# EAGLE design incubator (EAGLE 9.2.2)
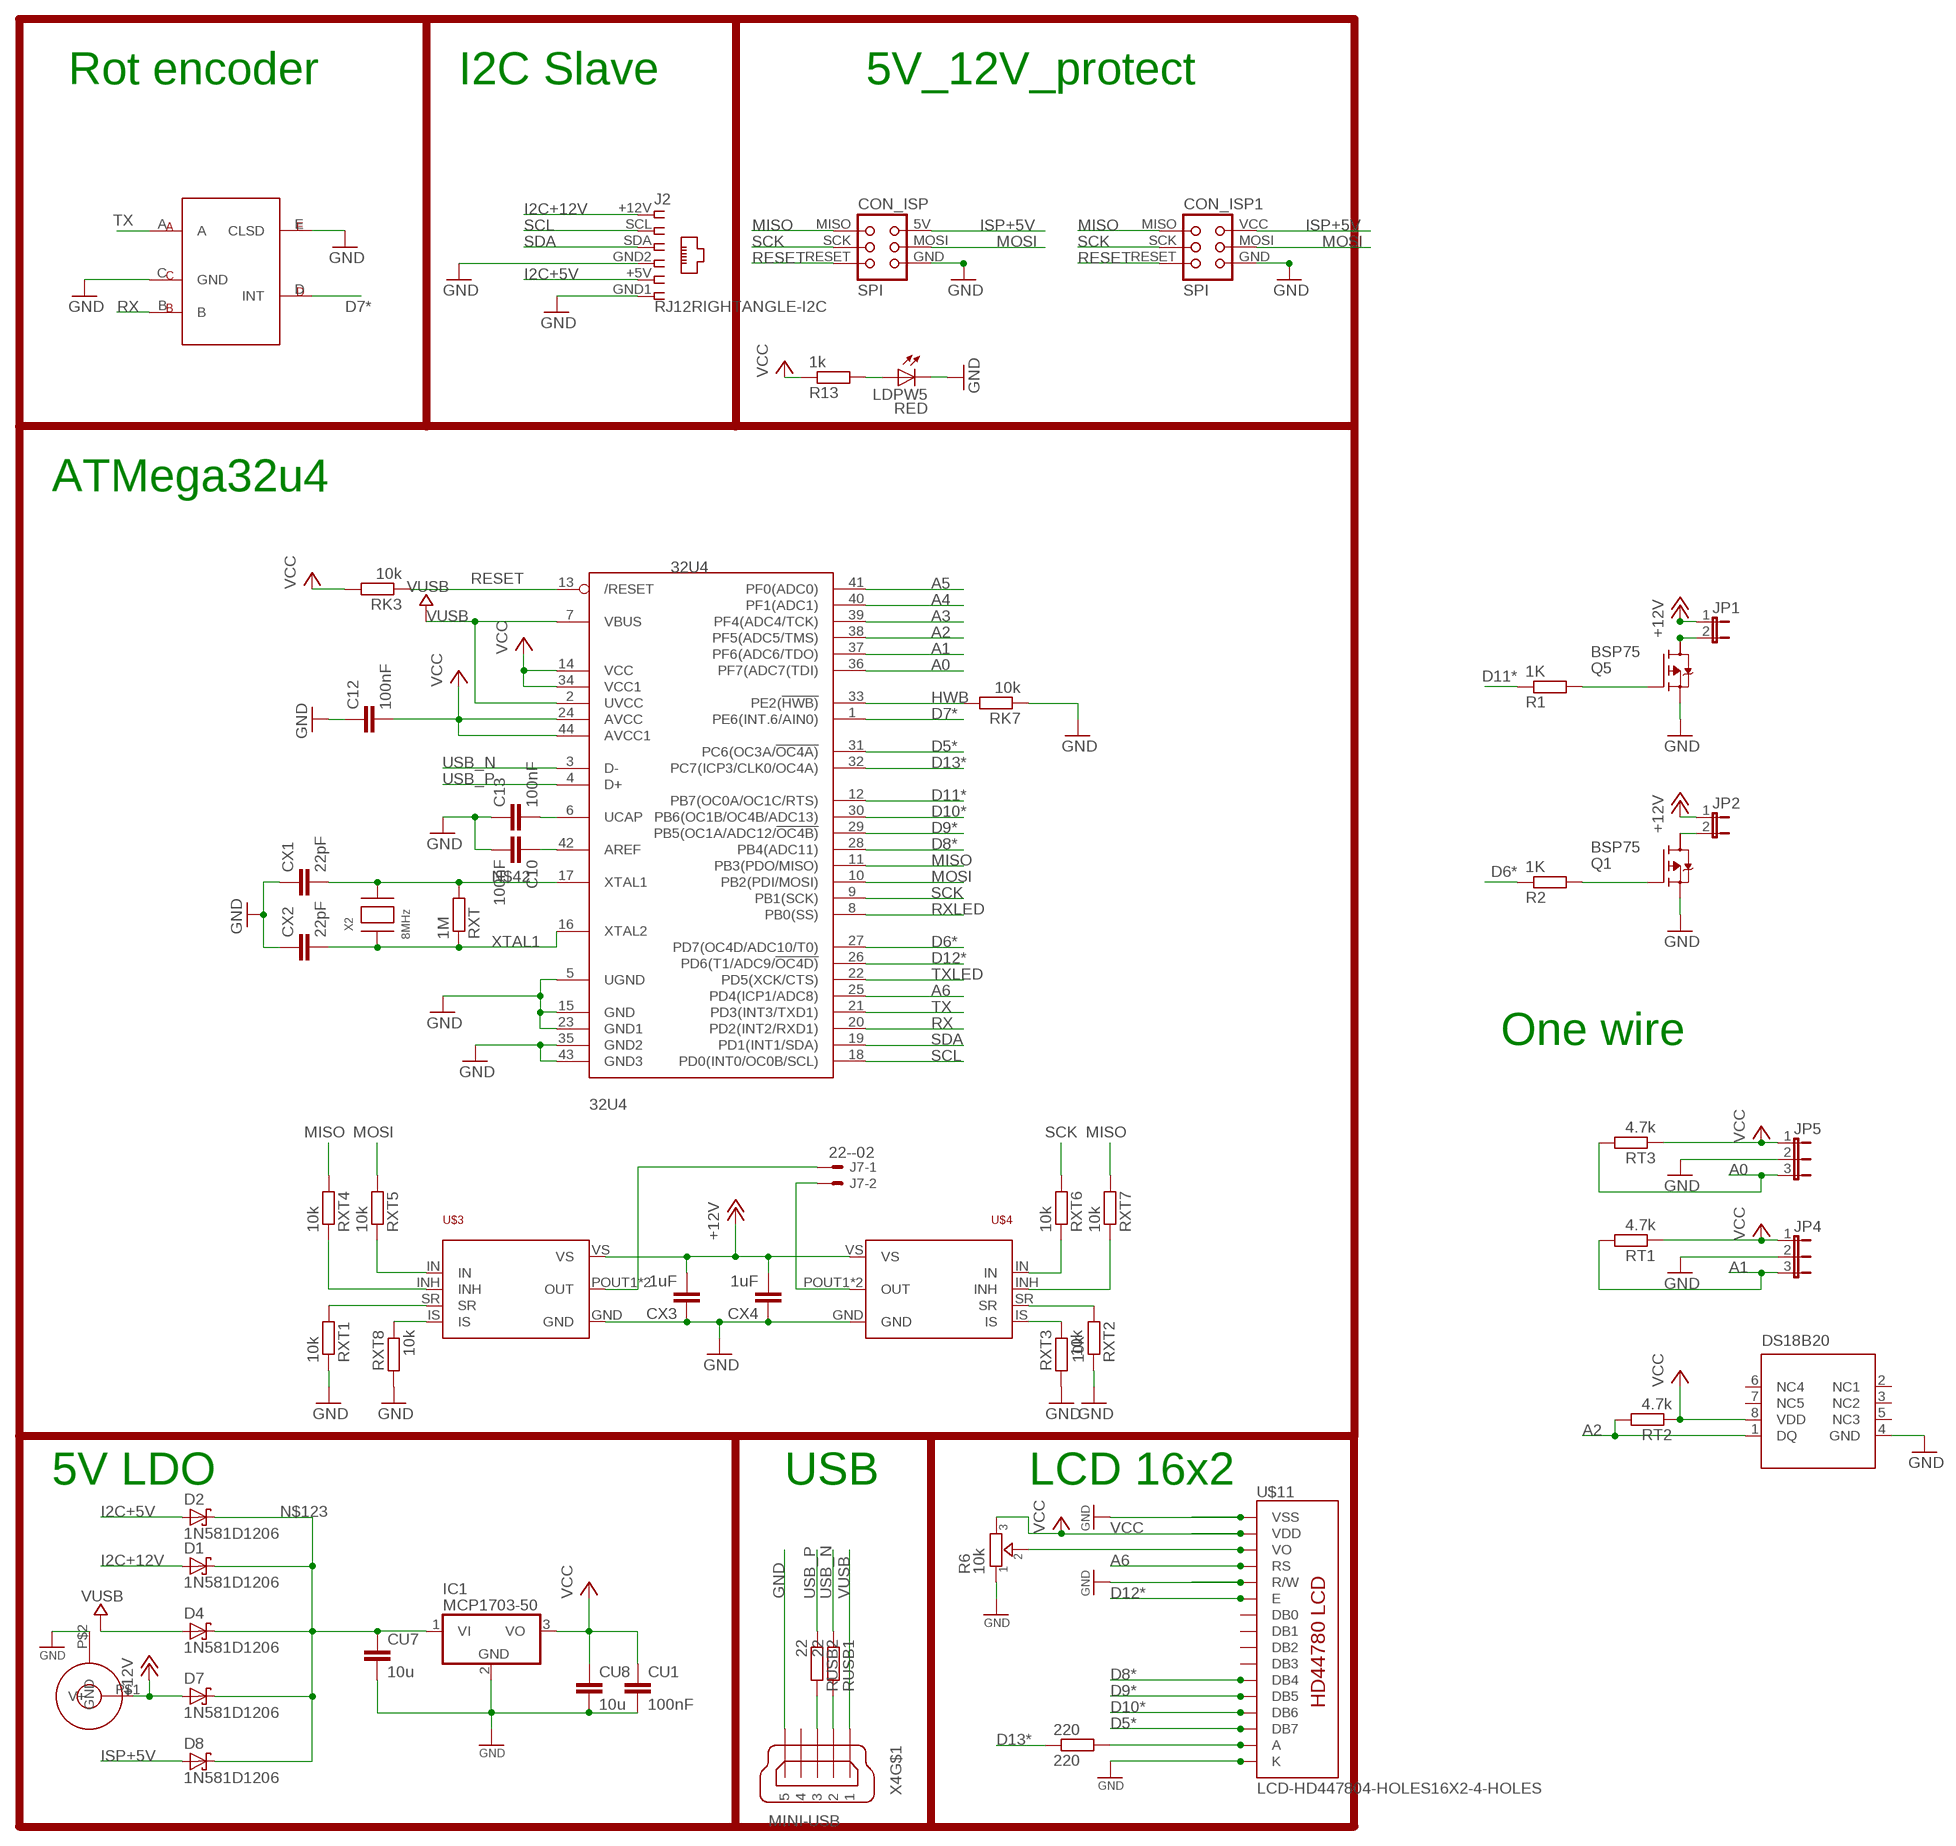
[diagram p0: schematic, sheet 1]

## Parts
32U4  32U4  ATMEGA32U4-AU  [TQFP44]
220  220  R-EU_R0805  [R0805]
C10  100nF  C-EUC0805  [C0805]
C12  100nF  C-EUC0805  [C0805]
C13  100nF  C-EUC0805  [C0805]
CON_ISP  SPI  TINYISPT  [TC2030-MCP-NL]
CON_ISP1  SPI  TINYISP  [TINYISP]
CU1  100nF  C-EUC0805  [C0805]
CU7  10u  C-EUC0805  [C0805]
CU8  10u  C-EUC0805  [C0805]
CX1  22pF  C-EUC0805  [C0805]
CX2  22pF  C-EUC0805  [C0805]
CX3  1uF  C-EUC0805  [C0805]
CX4  1uF  C-EUC0805  [C0805]
D1  1N581D1206  [LED-1206]
D2  1N581D1206  [LED-1206]
D4  1N581D1206  [LED-1206]
D7  1N581D1206  [LED-1206]
D8  1N581D1206  [LED-1206]
IC1  MCP1703-50  MCP1703DB  [SOT223]
J2  RJ12RIGHTANGLE-I2C  [RJ12-RIGHTANGLE-I2C]
J7  22--02  [2-PIN-5.08S]
JP1  JUMPER-2PTH  [1X02]
JP2  JUMPER-2PTH  [1X02]
JP4  JP2E  [JP2]
JP5  JP2E  [JP2]
LDPW5  RED  LEDCHIP-LED0805  [CHIP-LED0805]
POWER  JACK_DC_BARREL  [DC_BARREL]
Q1  BSP75  BSP613P  [PG-SOT-223]
Q5  BSP75  BSP613P  [PG-SOT-223]
R1  1K  R-EU_R0805  [R0805]
R2  1K  R-EU_R0805  [R0805]
R6  10k  TRIMMER-3362P  [TRIMMER_3362P]
R13  1k  R-EU_R0805  [R0805]
RK3  10k  R-EU_M0805  [M0805]
RK7  10k  R-EU_M0805  [M0805]
RT1  4.7k  R-EU_R0805  [R0805]
RT2  4.7k  R-EU_R0805  [R0805]
RT3  4.7k  R-EU_R0805  [R0805]
RUSB1  22  R-EU_M0805  [M0805]
RUSB2  22  R-EU_M0805  [M0805]
RXT  1M  R-EU_R0805  [R0805]
RXT1  10k  R-EU_R0805  [R0805]
RXT2  10k  R-EU_R0805  [R0805]
RXT3  10k  R-EU_R0805  [R0805]
RXT4  10k  R-EU_R0805  [R0805]
RXT5  10k  R-EU_R0805  [R0805]
RXT6  10k  R-EU_R0805  [R0805]
RXT7  10k  R-EU_R0805  [R0805]
RXT8  10k  R-EU_R0805  [R0805]
U$1  ROTARYENCODER  [ROTARYENCODER]
U$3  BTS7960  [P-TO-263-7]
U$4  BTS7960  [P-TO-263-7]
U$5  DS18B20  DS18B20SMALL  [MSOP8]
U$11  LCD-HD447804-HOLES16X2-4-HOLES  [LCD-16X2-4HOLES]
X2  8MHz  XTALNX6035  [NX6035]
X4  MINI-USB  MINI-USB-SCHIELD-32005-201  [32005-201]

## Nets
+12V [power]: CX3.2 CX4.2 D7.A JP1.1 JP2.1 POWER.P$1(V+) U$3.VS U$4.VS
A0: 32U4.36(PF7(ADC7(TDI)) JP5.3 RT3.2
A1: 32U4.37(PF6(ADC6/TDO)) JP4.3 RT1.2
A2: 32U4.38(PF5(ADC5/TMS)) RT2.2 U$5.1(DQ)
A3: 32U4.39(PF4(ADC4/TCK))
A4: 32U4.40(PF1(ADC1))
A5: 32U4.41(PF0(ADC0))
A6: 32U4.25(PD4(ICP1/ADC8)) U$11.4(RS)
AREF: 32U4.42(AREF) C10.1
D5*: 32U4.31(PC6(OC3A/!OC4A)) U$11.14(DB7)
D6*: 32U4.27(PD7(OC4D/ADC10/T0)) R2.1
D7*: 32U4.1(PE6(INT.6/AIN0)) U$1.D(INT)
D8*: 32U4.28(PB4(ADC11)) U$11.11(DB4)
D9*: 32U4.29(PB5(OC1A/ADC12/!OC4B)) U$11.12(DB5)
D10*: 32U4.30(PB6(OC1B/OC4B/ADC13)) U$11.13(DB6)
D11*: 32U4.12(PB7(OC0A/OC1C/RTS)) R1.1
D12*: 32U4.26(PD6(T1/ADC9/!OC4D)) U$11.6(E)
D13*: 32U4.32(PC7(ICP3/CLK0/OC4A)) 220.1
GND [power]: 32U4.5(UGND) 32U4.15(GND) 32U4.23(GND1) 32U4.35(GND2) 32U4.43(GND3) C10.2 C12.1 C13.1 CON_ISP1.GND CON_ISP.GND CU1.2 CU7.2 CU8.2 CX1.1 CX2.1 CX3.1 CX4.1 IC1.2(GND) J2.GND1 J2.GND2 JP4.2 JP5.2 LDPW5.C POWER.P$2(GND) Q1.3(S) Q5.3(S) R6.1 RK7.1 RXT1.1 RXT2.1 RXT3.2 RXT8.2 U$1.C(GND) U$1.E(CLSD) U$3.GND U$4.GND U$5.4(GND) U$11.1(VSS) U$11.5(R/W) U$11.16(K) X4.5
HWB: 32U4.33(PE2(!HWB)) RK7.2
I2C+5V: D2.A J2.+5V
I2C+12V [power]: D1.A J2.+12V
ISP+5V: CON_ISP1.VCC CON_ISP.5V(VCC) D8.A
MISO: 32U4.11(PB3(PDO/MISO)) CON_ISP1.MISO CON_ISP.MISO RXT4.2 RXT7.2
MOSI: 32U4.10(PB2(PDI/MOSI)) CON_ISP1.MOSI CON_ISP.MOSI RXT5.2
N$1: 32U4.6(UCAP) C13.2
N$2: R6.2 U$11.3(VO)
N$4: RXT5.1 U$3.IN
N$5: RXT6.1 U$4.IN
N$6: RXT4.1 U$3.INH
N$7: RXT7.1 U$4.INH
N$8: RXT3.1 U$4.IS
N$9: Q5.1(G) R1.2
N$10: RXT2.2 U$4.SR
N$11: 220.2 U$11.15(A)
N$12: LDPW5.A R13.2
N$13: RXT1.2 U$3.SR
N$14: RXT8.1 U$3.IS
N$19: J7.1 U$3.POUT1(OUT) U$3.POUT2(OUT)
N$20: Q1.1(G) R2.2
N$21: JP1.2 Q5.2(D)
N$22: J7.2 U$4.POUT1(OUT) U$4.POUT2(OUT)
N$23: JP2.2 Q1.2(D)
N$42: 32U4.17(XTAL1) CX1.2 RXT.2 X2.P$2
N$123: CU7.1 D1.C D2.C D4.C D7.C D8.C IC1.1(VI)
RESET: 32U4.13(/RESET) CON_ISP1.RESET CON_ISP.RESET RK3.1
RX: 32U4.20(PD2(INT2/RXD1)) U$1.B
RXLED: 32U4.8(PB0(SS))
SCK: 32U4.9(PB1(SCK)) CON_ISP1.SCK CON_ISP.SCK RXT6.2
SCL: 32U4.18(PD0(INT0/OC0B/SCL)) J2.SCL
SDA: 32U4.19(PD1(INT1/SDA)) J2.SDA
TX: 32U4.21(PD3(INT3/TXD1)) U$1.A
TXLED: 32U4.22(PD5(XCK/CTS))
USB_N: 32U4.3(D-) RUSB1.1
USB_P: 32U4.4(D+) RUSB2.1
USBC_N: RUSB1.2 X4.2
USBC_P: RUSB2.2 X4.3
VCC: 32U4.14(VCC) 32U4.24(AVCC) 32U4.34(VCC1) 32U4.44(AVCC1) C12.2 CU1.1 CU8.1 IC1.3(VO) JP4.1 JP5.1 R6.3 R13.1 RK3.2 RT1.1 RT2.1 RT3.1 U$5.8(VDD) U$11.2(VDD)
VUSB: 32U4.2(UVCC) 32U4.7(VBUS) D4.A X4.1
XTAL1: 32U4.16(XTAL2) CX2.2 RXT.1 X2.P$1
Unconnected: Q1.4(D) Q5.4(D) U$5.2(NC1) U$5.3(NC2) U$5.5(NC3) U$5.6(NC4) U$5.7(NC5) U$11.7(DB0) U$11.8(DB1) U$11.9(DB2) U$11.10(DB3) X4.4 X4.M1(S:S1) X4.M2(S:S2) X4.M3(S:S3) X4.M4(S:S4)

## Notes on the sheet
- Rot encoder | I2C Slave | 5V_12V_protect
- ATMega32u4
- One wire
- 5V LDO | USB | LCD 16x2

## Library data of the parts
32U4 = adafruit:ATMEGA32U4: http://www.ladyada.net/library/eagle
220 R1 R2 RXT RXT1-RXT8 = rcl:R-EU_: RESISTOR, European symbol; SPICEPREFIX: R
C10 C12 C13 CU1 CU7 CU8 CX1-CX4 = rcl:C-EU: CAPACITOR, European symbol; SPICEPREFIX: C
CON_ISP = lpatiny:TINYISP: CONNECTOR
CON_ISP1 = lpatiny:TINYISP: CONNECTOR; OC_FARNELL: unknown; OC_NEWARK: unknown
D1 D2 D4 D7 D8 = lpatiny:1N581*: 1.0A SCHOTTKY BARRIER RECTIFIER Source: http://www.diodes.com/datasheets/ds23001.pdf
IC1 = linear:MCP1703: 250 mA, 16V, Low Quiescent Current LDO Regulator Source: http://ww1.microchip.com/downloads/en/DeviceDoc/22049b.pdf
J2 = lpatiny:RJ12: CORCOM Modular RJ Jacks No Shield Source: www.tycoelectronics.com .. ENG_DS_1654001_1099_RJ_L_0507.pdf
J7 = lpatiny:22-?-02: CONNECTOR wire to board 2.54 mm (.1 inch) pitch header
JP1 JP2 = SparkFun:JUMPER-2: Jumper Basic 0.1" spaced jumper. Use with breakaway headers.
JP4 JP5 = jumper:JP2E: JUMPER
LDPW5 = adafruit:LED: LED OSRAM: - CHIPLED LG R971, LG N971, LY N971, LG Q971, LY Q971, LO R971, LY R971 LH N974, LH R974 LS Q976, LO Q976, LY Q976 LO Q996 - Hyper CHIPLED LW Q18S LB Q993, LB Q99A, LB R99A - SideLED LS A670, LO A670, LY A670, LG A670, LP A670 LB A673, LV A673, LT A673, LW A673 LH A674 LY A675 LS A676, LA A676, LO A676, LY A676, LW A676 LS A679, LY A679, LG A679 - Hyper Micro SIDELED® LS Y876, LA Y876, LO Y876, LY Y876 LT Y87S - SmartLED LW L88C, LW L88S LB L89C, LB L89S, LG L890 LS L89K, LO L89K, LY L89K LS L896, LA L896, LO L896, LY L896 - TOPLED LS T670, LO T670, LY T670, LG T670, LP T670 LSG T670, LSP T670, LSY T670, LOP T670, LYG T670 LG T671, LOG T671, LSG T671 LB T673, LV T673, LT T673, LW T673 LH T674 LS T676, LA T676, LO T676, LY T676, LB T676, LH T676, LSB T676, LW T676 LB T67C, LV T67C, LT T67C, LS T67K, LO T67K, LY T67K, LW E67C LS E67B, LA E67B, LO E67B, LY E67B, LB E67C, LV E67C, LT E67C LW T67C LS T679, LY T679, LG T679 LS T770, LO T770, LY T770, LG T770, LP T770 LB T773, LV T773, LT T773, LW T773 LH T774 LS E675, LA E675, LY E675, LS T675 LS T776, LA T776, LO T776, LY T776, LB T776 LHGB T686 LT T68C, LB T68C - Hyper Mini TOPLED® LB M676 - Mini TOPLED Santana® LG M470 LS M47K, LO M47K, LY M47K Source: http://www.osram.convergy.de/
POWER = lpatiny:JACK_DC_BARREL
Q1 Q5 = infineon:BSP613P: SIPMOS (R) Small-Signal-Transistor P-Channel (2 Drain) Source: http://www.infineon.com/dgdl/BSP613P_Rev2.4.pdf; OC_FARNELL: unknown; OC_NEWARK: unknown
R6 = dp_devices:TRIMMER: Trimmer resistor
R13 RK3 RK7 RT1-RT3 RUSB1 RUSB2 = resistor:R-EU_: RESISTOR, European symbol
U$1 = RotaryEncoder:ROTARYENCODER
U$3 U$4 = BTS7960:BTS7960; AVAILABILITY: Warning; DESCRIPTION: Half Bridge Motor Driver 7-Pin%286%2BTab%29 TO-263; MF: Infineon; MP: BTS7960B; PACKAGE: TO-263 Infineon; PRICE: 4.95 USD
U$5 = lpatiny:DS18B20
U$11 = HD44780LCD:LCD-HD44780
X2 = lpatiny:XTAL: Low cost SMT crystals, no capacitors included http://www.ladyada.net/library/eagle
X4 = con-cypressindustries:MINI-USB-SCHIELD-: MINI USB-B Conector Source: www.cypressindustries.com; OC_FARNELL: unknown; OC_NEWARK: unknown

## Net classes
0 default: width 0.203 mm, clearance 0.25 mm
1 power: width 0.203 mm, drill 0.305 mm, clearance 0.25 mm
2 VIN: width 0.406 mm, clearance 0.25 mm
3 fine: width 0.406 mm, clearance 0.25 mm
4 aref: width 0.406 mm, clearance 0.25 mm

## Board
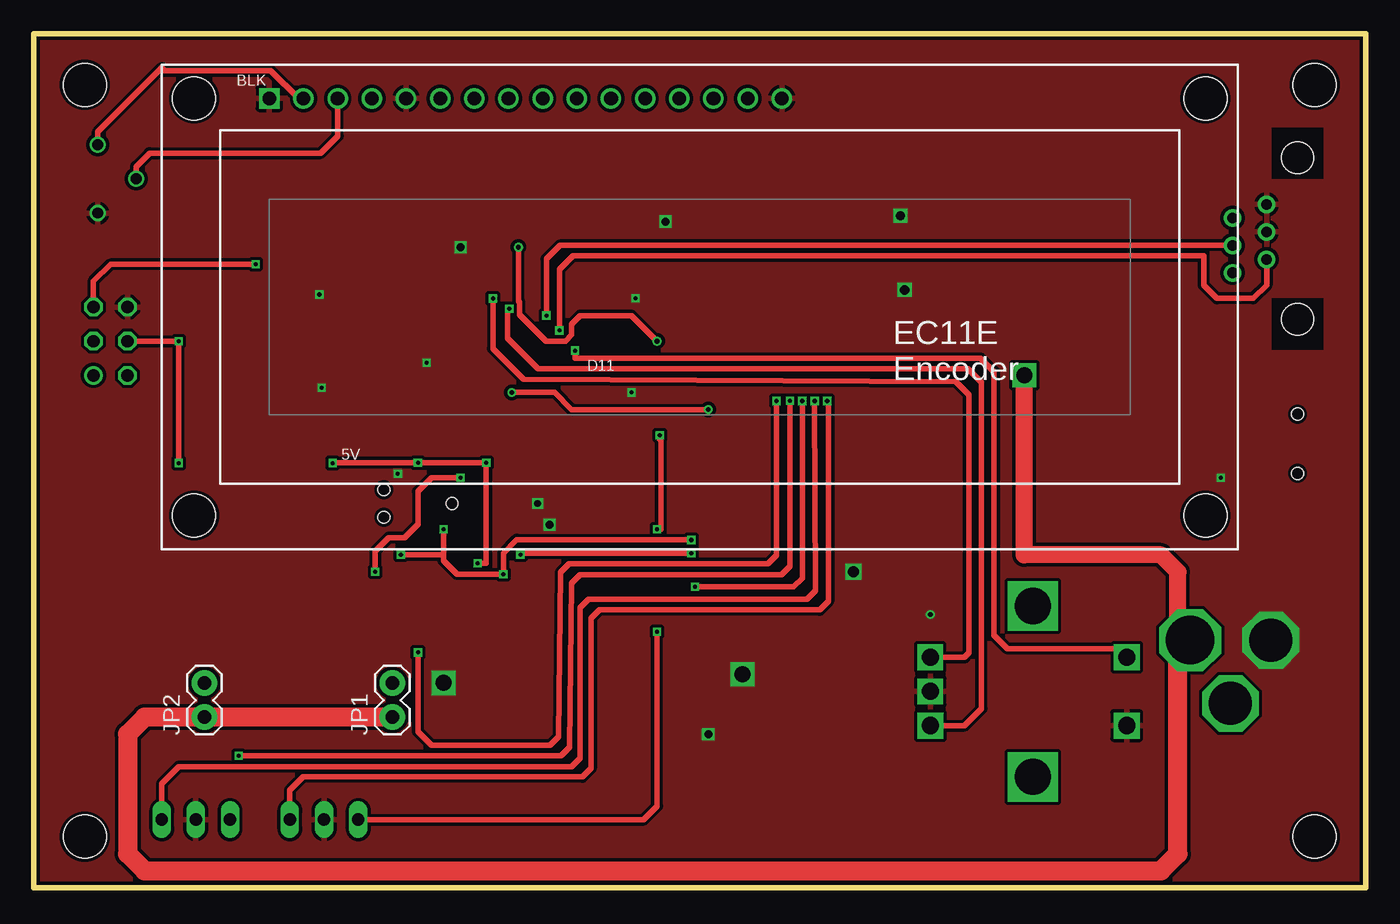
[diagram p1: board, top side]
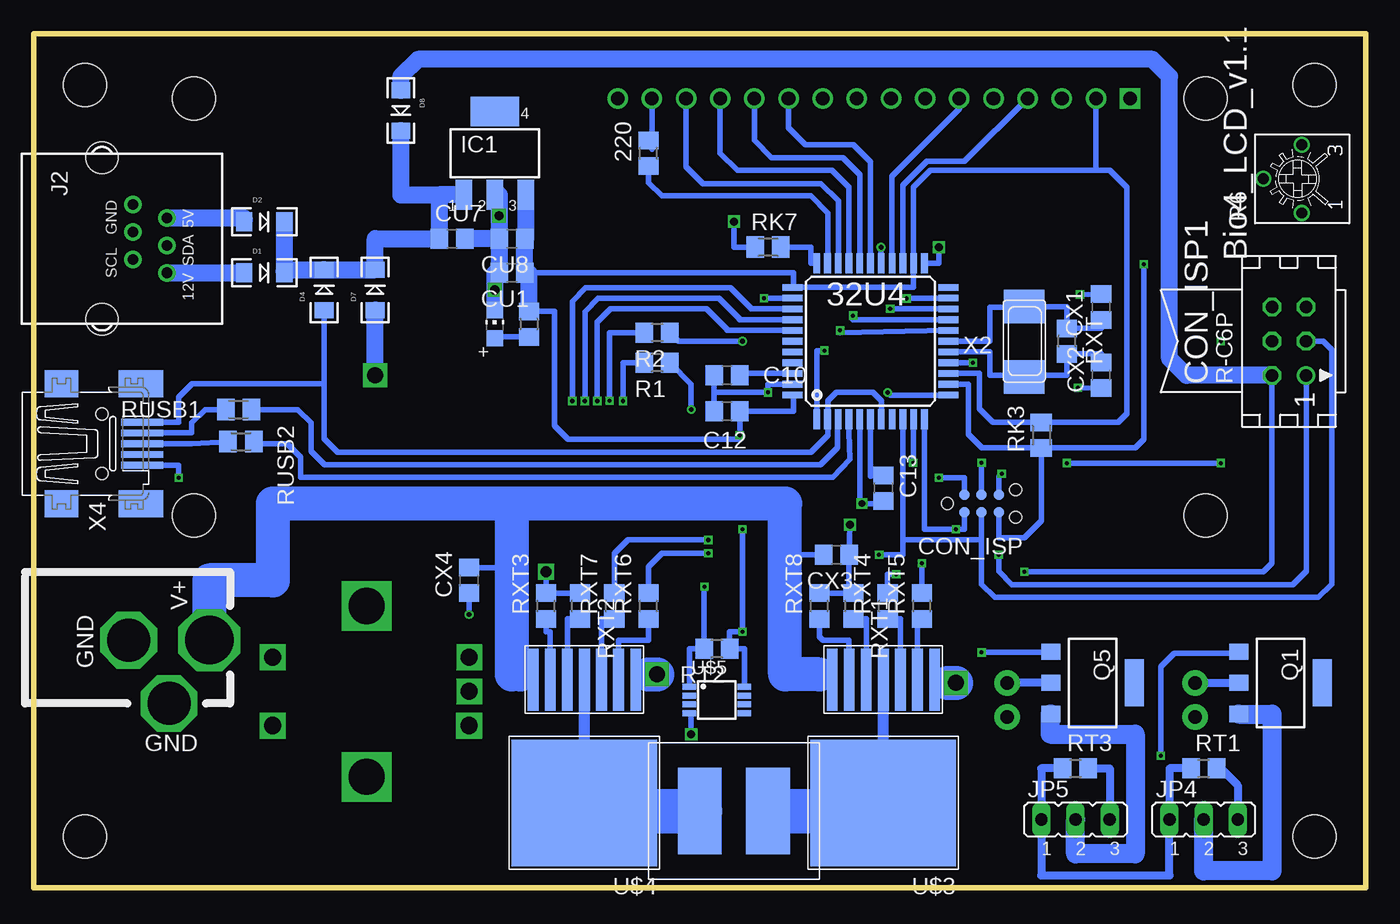
[diagram p2: board, bottom side, seen from below]

Size 99.06 x 63.5 mm. Coordinates in mm from the lower left corner, seen from the top.
Outline: 0,63.5 0,0 99.06,0 99.06,63.5 0,63.5
Copper layers (1*2*15*16): Top 0.035mm / dielectric 0.2mm / Route2 0.0175mm / dielectric 1.1mm / Route15 0.0175mm / dielectric 0.2mm / Bottom 0.035mm
Design rules "SeeedStudio_DRU_no_angle_20130527": minimum track width 6mil, minimum drill 12mil, track to track 6mil, track to pad 6mil, pad to pad 6mil, via to via 6mil, smd to smd 0mil, copper to edge 10mil, drill to drill 10mil, minimum pad ring 6mil, minimum via ring 6mil, stop-mask expansion 2mil, vias tented up to drill 25mil, thermal gap 10mil
Holes 3.2 mm at 3.81,59.69 3.81,3.81 95.25,59.69 95.25,3.81

### Footprints (pad centres in the part's own frame; a part is rotated, then mirrored left to right if it is on the bottom)
TQFP44 = smd 1.5 x 0.5: 1 -5.8,4; 2 -5.8,3.2; 3 -5.8,2.4; 4 -5.8,1.6; 5 -5.8,0.8; 6 -5.8,0; 7 -5.8,-0.8; 8 -5.8,-1.6; 9 -5.8,-2.4; 10 -5.8,-3.2; 11 -5.8,-4; 23 5.8,-4; 24 5.8,-3.2; 25 5.8,-2.4; 26 5.8,-1.6; 27 5.8,-0.8; 28 5.8,0; 29 5.8,0.8; 30 5.8,1.6; 31 5.8,2.4; 32 5.8,3.2; 33 5.8,4 | smd 0.5 x 1.5: 12 -4,-5.8; 13 -3.2,-5.8; 14 -2.4,-5.8; 15 -1.6,-5.8; 16 -0.8,-5.8; 17 0,-5.8; 18 0.8,-5.8; 19 1.6,-5.8; 20 2.4,-5.8; 21 3.2,-5.8; 22 4,-5.8; 34 4,5.8; 35 3.2,5.8; 36 2.4,5.8; 37 1.6,5.8; 38 0.8,5.8; 39 0,5.8; 40 -0.8,5.8; 41 -1.6,5.8; 42 -2.4,5.8; 43 -3.2,5.8; 44 -4,5.8
R0805 = smd 1.3 x 1.5: 1 -0.95,0; 2 0.95,0
C0805 = smd 1.3 x 1.5: 1 -0.95,0; 2 0.95,0
TC2030-MCP-NL = smd 0.787 x 0.787: 5V 1.27,0.635; GND 3.81,0.635; MISO 1.27,-0.635; MOSI 2.54,0.635; RESET 3.81,-0.635; SCK 2.54,-0.635 | hole 0.889: 0,0; 5.08,-1.016; 5.08,1.016
TINYISP = drill 0.914 octagon: GND 2.54,1.27; MOSI 0,1.27; RESET 2.54,-1.27; SCK 0,-1.27; VCC -2.54,1.27 | drill 0.914: MISO -2.54,-1.27
LED-1206 = smd 1.2 x 1.4: A -1.5,0; C 1.5,0
SOT223 = smd 1.219 x 2.235: 1 -2.311,-3.099; 2 0,-3.099; 3 2.311,-3.099 | smd 3.6 x 2.2: 4 0,3.099
RJ12-RIGHTANGLE-I2C = drill 0.8 pad 1.3: +5V -1.54,4.84; +12V 2.54,4.84; GND1 -2.54,2.3; GND2 -0.5,2.3; SCL 1.54,2.3; SDA 0.5,4.84 | hole 2.36: -6,0; 6,0
2-PIN-5.08S = smd 3.251 x 6.452: 1 -2.54,0; 2 2.54,0
1X02 = drill 1.016 pad 1.88: 1 0,0; 2 2.54,0
JP2 = drill 0.914 long: 1 -2.54,0; 2 0,0; 3 2.54,0
CHIP-LED0805 = smd 1.2 x 1.2: A 0,-1.05; C 0,1.05
DC_BARREL = drill 3.6 pad 4.5 octagon: P$1 0,13.7 | drill 3.2 pad 4.064 octagon: P$2 0,7.7; P$3 4.7,10.7
PG-SOT-223 = smd 1.2 x 1.4: 1 -2.311,-3.099; 2 0,-3.099; 3 2.311,-3.099 | smd 3.5 x 1.4: 4 0,3.099
TRIMMER_3362P = drill 0.8: 1 -2.54,-0.31; 2 0,2.54; 3 2.54,-0.31
M0805 = smd 1.3 x 1.6: 1 -0.95,0; 2 0.95,0
ROTARYENCODER = drill 1.27 square: A -8.255,2.54; C -8.255,0 | drill 1.286 square: B -8.255,-2.54; D 6.35,2.54; E 6.35,-2.54 | drill 2.683 square: P$1 -0.635,-6.35 | drill 2.682 square: P$2 -0.635,6.35
P-TO-263-7 = smd 0.8 x 4.6: GND 1.59,2.3; IN 2.86,2.3; INH 4.13,2.3; IS 7.94,2.3; POUT2 5.4,2.3; SR 6.67,2.3; VS 9.21,2.3 | smd 10.8 x 9.4: POUT1 5.4,11.45
MSOP8 = smd 0.45 x 1: 1 -0.975,-2.05; 2 -0.325,-2.05; 3 0.325,-2.05; 4 0.975,-2.05; 5 0.975,2.05; 6 0.325,2.05; 7 -0.325,2.05; 8 -0.975,2.05
LCD-16X2-4HOLES = drill 1.016 square: 1 -32,15.5 | drill 1.016: 2 -29.46,15.5; 3 -26.92,15.5; 4 -24.38,15.5; 5 -21.84,15.5; 6 -19.3,15.5; 7 -16.76,15.5; 8 -14.22,15.5; 9 -11.68,15.5; 10 -9.14,15.5; 11 -6.6,15.5; 12 -4.06,15.5; 13 -1.52,15.5; 14 1.02,15.5; 15 3.56,15.5; 16 6.1,15.5 | hole 3.2: -37.6,15.5; -37.6,-15.5; 37.6,-15.5; 37.6,15.5
NX6035 = smd 2.5 x 3: P$1 2.665,0; P$2 -2.565,0
32005-201 = smd 3.1 x 0.5: 1 3,1.6; 2 3,0.8; 3 3,0; 4 3,-0.8; 5 3,-1.6 | smd 2.5 x 2: M1 -3,-4.45; M2 -3,4.45 | smd 3.3 x 2: M3 2.9,4.45; M4 2.9,-4.45 | hole 0.9: 0,2.2; 0,-2.2

### Placement (x,y rotation side)
32U4  36.83,40.64 90 bottom
220  53.34,54.61 90 bottom
C10  47.5,38.1 180 bottom
C12  47.5,35.44 0 bottom
C13  35.88,29.72 90 bottom
CON_ISP  31.11,28.57 0 bottom
CON_ISP1  5.71,40.64 90 bottom
CU1  63.5,45.72 180 bottom
CU7  67.94,48.26 0 bottom
CU8  63.5,48.26 180 bottom
CX1  19.68,43.18 270 bottom
CX2  19.68,38.1 90 bottom
CX3  39.37,24.77 180 bottom
CX4  66.67,22.86 90 bottom
D1  81.92,45.72 0 bottom
D2  81.92,49.53 0 bottom
D4  77.47,44.45 90 bottom
D7  73.66,44.45 90 bottom
D8  71.75,57.78 270 bottom
IC1  64.77,54.61 0 bottom
J2  93.98,48.26 270 bottom
J7  46.99,5.71 180 bottom
JP1  26.67,12.7 90 top
JP2  12.7,12.7 90 top
JP4  12.06,5.08 0 bottom
JP5  21.59,5.08 0 bottom
LDPW5  64.77,41.91 0 bottom
POWER  99.69,18.41 270 bottom
Q1  6.35,15.24 270 bottom
Q5  20.32,15.24 270 bottom
R1  52.7,39.03 180 bottom
R2  52.7,41.27 180 bottom
R6  5.08,52.7 90 bottom
R13  62.23,41.91 270 bottom
RK3  24.13,33.66 90 bottom
RK7  44.45,47.62 0 bottom
RT1  12.06,8.89 0 bottom
RT2  48.26,17.78 180 bottom
RT3  21.59,8.89 0 bottom
RUSB1  83.82,35.56 180 bottom
RUSB2  83.65,33.17 180 bottom
RXT  22.23,40.64 90 bottom
RXT1  38.1,20.95 270 bottom
RXT2  58.42,20.95 270 bottom
RXT3  60.96,20.95 90 bottom
RXT4  35.56,20.95 90 bottom
RXT5  33.02,20.95 90 bottom
RXT6  53.34,20.95 90 bottom
RXT7  55.88,20.95 90 bottom
RXT8  40.64,20.95 90 bottom
U$1  74.93,14.61 0 top
U$3  30.48,17.78 180 bottom
U$4  52.7,17.78 180 bottom
U$5  48.26,13.97 270 bottom
U$11  49.53,43.18 0 top
X2  25.4,40.64 270 bottom
X4  93.98,33.02 0 bottom

### Tracks (layer width: path | path; a pad name or v marks a point on that pad's centre or on a via)
+12V  (via drill 1.2)
  Top 1.27: 85.09,18.41 85.09,23.5 83.82,24.77 73.66,24.77 v73.66,38.1
  Top 1.422: JP1.1 JP2.1 8.26,12.7 6.99,11.43 6.99,2.54 8.26,1.27 83.82,1.27 85.09,2.54 85.09,18.41 POWER.P$1
  Bottom 0.406: CX3.2 43.18,24.77 | CX4.2 63.5,23.81 63.5,23.5
  Bottom 0.813: U$3.VS 40.64,15.48 40.64,15.88 | U$4.VS 62.87,15.48 62.87,15.88
  Bottom 1.27: v73.66,38.1 D7.A
  Bottom 2.54: 40.64,15.88 43.18,15.88 43.18,24.77 43.18,28.57 63.5,28.57 | 63.5,28.57 81.28,28.57 81.28,22.86 86,22.86 POWER.P$1 | 62.87,15.88 63.5,15.88 63.5,23.5 63.5,28.57
A0  (via drill 0.3)
  Top 0.406: v59,36.2 59.1,36.2 59.1,21.31 58.46,20.68 42.08,20.68 41.45,20.04 41.45,8.89 40.81,8.26 20.05,8.26 19.05,7.25 JP5.3
  Bottom 0.406: 32U4.36 45.72,43.04 45.72,43.1 47.24,44.62 58,44.62 59,43.62 v59,36.2
  Bottom 0.61: RT3.2 19.05,8.89 JP5.3
A1  (via drill 0.3)
  Top 0.406: v58.08,36.2 58.13,22.11 57.49,21.47 41.27,21.47 40.64,20.83 40.64,9.65 40.01,9.01 10.79,9.01 9.53,7.74 JP4.3
  Bottom 0.406: 32U4.37 46.56,42.24 46.56,42.29 48.09,43.81 57.08,43.81 58.08,42.81 v58.08,36.2
  Bottom 0.61: RT1.2 10.79,8.89 9.53,7.62 JP4.3
A2  (via drill 0.3)
  Top 0.406: v57.15,36.2 57.15,23.03 56.52,22.4 v49.19,22.4
  Bottom 0.406: U$5.1 50.31,17.78 RT2.2 49.21,22.23 v49.19,22.4 | 32U4.38 47.49,41.44 47.49,41.51 49.02,43.03 56.15,43.03 57.15,42.03 v57.15,36.2
A6
  Bottom 0.406: U$11.4 29.83,54 32.66,54 34.43,52.22 32U4.25
AREF
  Bottom 0.406: 32U4.42 46.55,38.24 C10.1
D5*
  Bottom 0.406: U$11.14 50.55,53.61 49.28,52.34 40.5,52.34 39.23,51.07 32U4.31
D6*  (via drill 0.35)
  Top 0.406: v46.35,40.64 44.45,42.55 40.64,42.55 40.01,41.91 40.01,41.1 39.54,40.64 38.1,40.64 36.13,42.61 36.13,43.55 36.05,43.62 v36.05,47.62
  Bottom 0.406: R2.1 51.12,40.64 v46.35,40.64 | v36.05,47.62 36.05,46.46 32U4.27
D7*  (via drill 0.3)
  Top 0.406: v40.26,39.94 40.26,39.37 70.41,39.37 71.41,38.37 71.41,18.78 72.41,17.78 80.64,17.78 U$1.D
  Bottom 0.406: v40.26,39.94 40.83,39.94 32U4.1
D8*
  Bottom 0.406: U$11.11 42.93,56.52 41.66,55.24 38.1,55.24 36.83,53.98 32U4.28
D9*
  Bottom 0.406: U$11.12 45.47,55.56 44.2,54.29 38.9,54.29 37.63,53.02 32U4.29
D10*
  Bottom 0.406: U$11.13 48.01,54.61 46.74,53.34 39.7,53.34 38.43,52.07 32U4.30
D11*  (via drill 0.35)
  Top 0.406: v35.56,36.83 38.73,36.83 40.01,35.56 v50.16,35.56
  Bottom 0.406: R1.1 50.16,37.44 v50.16,35.56 | 32U4.12 35.37,36.64 v35.56,36.83
D12*
  Bottom 0.406: 32U4.26 35.23,52.91 30.23,57.91 U$11.6
D13*
  Bottom 0.406: 32U4.32 40.01,46.44 40.01,50.16 41.27,51.44 52.34,51.44 53.34,52.44 220.1
GND  (via drill 0.3, 0.35, 0.5 pad 0.61, 0.6, 0.7, 0.8, 1.2)
  Bottom 0.406: 32U4.43 44.45,37.44 v44.45,36.83 48.45,36.83 C10.2 C12.1 | 32U4.5 37.63,28.57 v37.47,28.57 35.88,28.57 C13.1 | CU1.2 64.77,45.72 | X4.5 88.27,31.42 v88.27,30.48 | v44.77,43.84 32U4.35 | CX1.1 v21.25,44.11 | 32U4.15 v29.22,39.04 | v29.22,39.04 | CON_ISP.GND 27.3,30.56 v27.08,30.79 | RK7.1 46.99,47.62 v46.99,49.53 | CX2.1 v21.42,37.17 | RXT8.2 RXT1.1 38.42,21.91 CX3.1 v38.37,26.99 | U$5.4 arc90 50.16,12.85 v50.16,11.43 | 32U4.23 31.75,46.44 v31.75,47.62 | RXT2.1 RXT3.2 v60.96,23.5 | CX4.1 v66.67,20.32
  Bottom 0.813: U$4.GND 53.34,15.48 53.34,15.88 | U$3.GND 31.75,15.48 31.11,15.24
  Bottom 1.27: IC1.2 64.45,51.51 v64.45,49.97 CU8.2 | CU8.2 CU7.2 | CU8.2 CU1.2 | LDPW5.C v64.77,44.45 64.77,45.72
  Bottom 1.422: Q1.3 6.99,12.93 6.99,1.27 12.06,1.27 JP4.2 | Q5.3 23.5,12.93 23.5,11.43 17.14,11.43 17.14,2.54 21.59,2.54 JP5.2
  Bottom 2.54: 53.34,15.88 v52.7,15.88 | 31.11,15.24 v30.48,15.24
  pour Top: 0,63.5 0,0 99.06,0 99.06,63.5
HWB
  Bottom 0.406: 32U4.33 41.27,46.44 41.27,47.62 RK7.2
I2C+5V
  Bottom 1.27: J2.+5V 83.42,49.8 D2.A
I2C+12V
  Bottom 1.27: J2.+12V D1.A
ISP+5V  (via drill 0.3)
  Top 0.406: v31.75,30.48 29.57,30.48 28.57,29.48 28.57,27.04 27.57,26.04 26.4,26.04 25.4,25.04 v25.4,23.5
  Bottom 0.406: CON_ISP.5V 29.84,30.48 v31.75,30.48 | v25.4,23.5 7.62,23.5 6.99,24.13 CON_ISP1.VCC
  Bottom 1.27: CON_ISP1.VCC 13.34,38.1 14.61,39.37 14.61,60.33 15.88,61.59 70.48,61.59 71.75,60.33 D8.A
MISO  (via drill 0.3)
  Top 0.406: v27.3,24.77 30.48,24.77 v30.48,26.67 30.48,24.32 31.48,23.32 v34.92,23.32 34.92,24.89 35.92,25.89 48.9,25.89 v48.9,25.86
  Bottom 0.406: CON_ISP.MISO 29.84,26.67 v30.48,26.67 32.83,26.67 32U4.11 | CON_ISP1.MISO 4.45,23.53 5.45,22.53 26.3,22.53 27.3,23.53 v27.3,24.77 | RXT7.2 55.88,24.86 54.88,25.86 v48.9,25.86 | v34.92,23.32 35.56,23.32 RXT4.2
MOSI  (via drill 0.3)
  Top 0.406: CON_ISP1.MOSI v10.79,40.64 v10.79,31.58 | v22.23,31.58 22.23,31.61 v28.57,31.61 v33.66,31.61 33.66,24.13 v33.02,24.13
  Bottom 0.406: CON_ISP.MOSI v28.57,31.61 | v22.23,31.58 v10.79,31.58 | 32U4.10 33.66,34.84 v33.66,31.61 | v33.02,24.13 RXT5.2
N$1
  Bottom 0.406: C13.2 36.83,30.61 32U4.6
N$2
  Top 0.406: R6.2 7.62,53.61 8.62,54.61 21.34,54.61 22.61,55.88 U$11.3
N$4
  Bottom 0.406: RXT5.1 33.34,20 U$3.IN
N$5
  Bottom 0.406: RXT6.1 53.34,18.41 55.56,18.41 U$4.IN
N$6
  Bottom 0.406: RXT4.1 34.61,20 U$3.INH
N$7
  Bottom 0.406: RXT7.1 56.84,20 U$4.INH
N$8
  Bottom 0.406: RXT3.1 60.96,19.05 60.65,19.05 U$4.IS
N$9  (via drill 0.3)
  Top 0.406: v55.24,36.2 55.24,24.71 54.61,24.08 39.83,24.08 39.19,23.45 39.03,11.25 38.4,10.62 29.57,10.62 28.57,11.62 v28.57,17.51
  Bottom 0.406: R1.2 55.24,39.03 v55.24,36.2 | v28.57,17.51 23.42,17.51 Q5.1
N$10
  Bottom 0.406: RXT2.2 59.38,20 U$4.SR
N$11
  Bottom 0.406: U$11.15 53.09,54.92 220.2
N$12
  Bottom 0.406: R13.2 64.77,40.96 LDPW5.A
N$13
  Bottom 0.406: RXT1.2 37.15,20 U$3.SR
N$14
  Bottom 0.406: RXT8.1 40.64,18.67 40.39,18.41 38.42,18.41 U$3.IS
N$19
  Bottom 0.813: U$3.POUT1 U$3.POUT2
  Bottom 3.302: J7.1 35.88,5.71 U$3.POUT1
N$20  (via drill 0.3)
  Top 0.406: v56.24,36.21 56.24,23.9 55.6,23.27 40.63,23.27 40,22.64 39.84,10.44 39.21,9.82 v15.24,9.82
  Bottom 0.406: R2.2 56.24,41.27 v56.24,36.21 | v15.24,9.82 15.24,16.44 14.24,17.44 9.45,17.44 Q1.1
N$21
  Bottom 0.61: Q5.2 JP1.2
N$22
  Bottom 0.813: U$4.POUT1 U$4.POUT2
  Bottom 3.302: J7.2 58.1,5.71 U$4.POUT1
N$23
  Bottom 0.61: JP2.2 Q1.2
N$42
  Bottom 0.406: 32U4.17 27.94,40.64 27.94,43.18 25.4,43.18 X2.P$2 22.23,43.2 RXT.2 19.68,41.59 CX1.2
N$123
  Bottom 1.27: D8.C 71.75,51.51 68.89,51.51 | D2.C D1.C 80.42,45.95 D4.C D7.C 73.66,48.26 CU7.1 68.89,51.51 | IC1.1 68.89,51.51
RESET  (via drill 0.3)
  Top 0.406: v16.51,46.35 5.71,46.35 4.45,45.09 CON_ISP1.RESET
  Bottom 0.406: 32U4.13 29.54,37.44 29.54,33.7 28.54,32.7 RK3.1 | CON_ISP.RESET 27.3,26.04 25.4,26.04 24.13,27.3 RK3.1 | RK3.1 17.14,32.7 16.51,33.34 v16.51,46.35
RX  (via drill 0.3)
  Top 0.406: v35.37,43.05 35.26,43.05 35.26,40.87 37.52,38.59 69.48,38.59 70.48,37.59 70.48,13.34 69.22,12.06 U$1.B
  Bottom 0.406: 32U4.20 34.1,43.04 34.11,43.05 v35.37,43.05
SCK  (via drill 0.3)
  Top 0.406: v48.9,24.89 36.2,24.89 v36.2,24.77
  Bottom 0.406: CON_ISP.SCK 28.57,25.87 | 28.57,25.87 34.43,25.87 | 34.43,25.87 32U4.9 | CON_ISP1.SCK 3.17,40.64 2.54,40.01 2.54,22.59 3.54,21.59 27.57,21.59 28.57,22.59 28.57,25.87 | RXT6.2 53.34,23.89 52.34,24.89 v48.9,24.89 | v36.2,24.77 34.43,24.77 34.43,25.87
SCL  (via drill 0.3)
  Top 0.406: v39.09,41.44 39.09,45.99 40.09,46.99 87,46.99 87,44.81 88,43.81 90.68,43.81 91.68,44.81 J2.SCL
  Bottom 0.406: v39.09,41.44 39.09,41.27 32U4.18
SDA  (via drill 0.3)
  Top 0.406: J2.SDA 39.12,47.76 38.12,46.76 v38.12,42.55
  Bottom 0.406: v38.12,42.55 38.15,42.24 32U4.19
TX  (via drill 0.3)
  Top 0.406: v34.15,43.81 34.15,40.08 36.41,37.8 68.56,37.64 69.56,36.64 69.56,17.49 69.22,17.14 U$1.A
  Bottom 0.406: v34.15,43.81 32U4.21
USB_N
  Bottom 0.406: 32U4.3 39.29,34.84 39.29,32.73 40.56,31.46 52.7,31.46 52.7,31.45 77.42,31.45 78.42,32.45 78.42,34.56 79.42,35.56 RUSB1.1
USB_P
  Bottom 0.406: 32U4.4 38.47,34.84 38.35,31.85 39.62,30.53 79.2,30.53 79.2,32 80.2,33 82.7,33 RUSB2.1
USBC_N
  Bottom 0.406: X4.2 87.3,33.82 87.3,34.56 86.3,35.56 RUSB1.2
USBC_P
  Bottom 0.406: X4.3 87.3,33.02 87.3,33 RUSB2.2
VCC  (via drill 0.3)
  Top 0.406: JP5.1 45.35,5.08 46.35,6.08 v46.35,19.05 | v46.35,26.67 46.63,26.67 46.63,33.36 46.55,33.36 v46.55,33.66 | R6.3 4.77,56.2 9.53,60.96 9.75,60.74 17.64,60.74 19.7,58.68 U$11.2
  Bottom 0.406: 32U4.44 42.55,36.64 42.55,35.44 C12.2 v46.55,33.66 46.55,33.36 59.33,33.36 60.33,34.36 60.33,42.86 R13.1 | 32U4.14 28.74,38.24 28.74,35.6 27.74,34.6 RK3.2 18.41,34.6 17.78,35.24 17.78,52.07 19.05,53.34 20.07,53.34 | U$5.8 46.21,17.78 RT2.1 47.31,19.05 v46.35,19.05 v46.35,26.67 | CU1.1 42.55,45.72 42.55,44.64 32U4.34 33.66,44.64 33.66,46.44 | 32U4.24 33.66,46.44 | U$11.2 20.07,53.34 | 20.07,53.34 32.38,53.34 33.66,52.07 33.66,46.44
  Bottom 0.61: RT1.1 14.61,8.89 JP4.1 14.61,0.93 24.13,0.93 JP5.1 24.13,8.89 RT3.1
  Bottom 1.27: R13.1 62.23,45.72 CU1.1 CU8.1 62.46,48.26 IC1.3
VUSB
  Bottom 0.406: 40.01,34.84 40.01,36.2 39.37,36.83 36.66,36.83 36.03,36.2 32U4.7 | 32U4.2 40.01,34.84 | 40.01,34.84 40.01,33.66 41.27,32.38 76.47,32.38 77.47,33.38 77.47,37.47 | 77.47,37.47 87.27,37.47 88.27,36.47 88.27,34.62 X4.1 | D4.A 77.47,37.47
XTAL1
  Bottom 0.406: 25.4,38.1 22.23,38.1 RXT.1 19.68,39.69 CX2.2 | 25.4,38.1 X2.P$1 | 25.4,38.1 27.94,38.1 27.94,39.84 32U4.16

### Text on the board
tNames: 1 | BLK | D11 | EC11E / Encoder | 5V
bNames: Bio4_LCD_v1.1
tValues: Incubator v1.1.0
bValues: Incubator v1.1.0